# EAGLE schematic SLock_Main_Device (EAGLE 9.5.2)
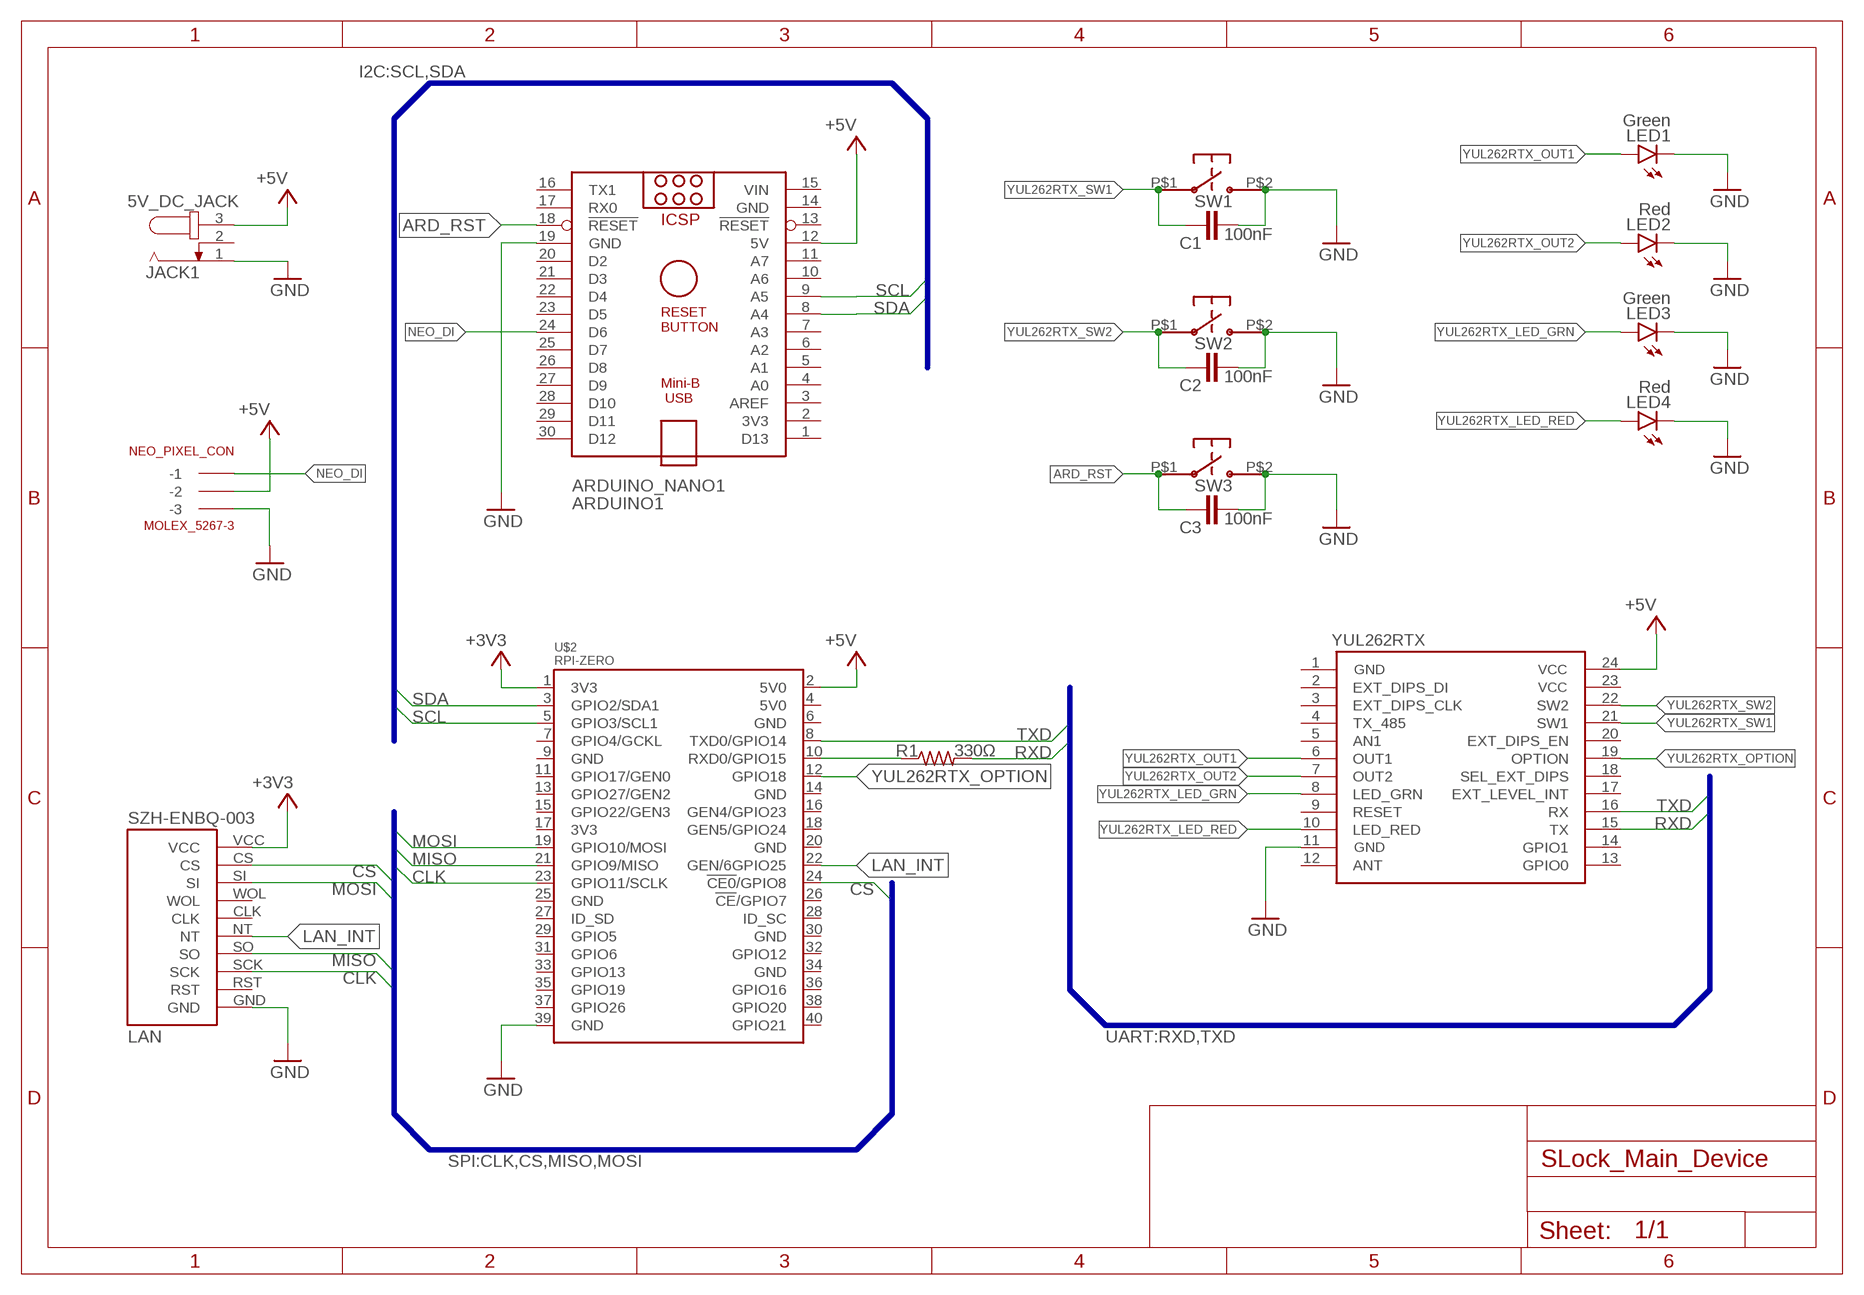
[diagram p0: schematic, sheet 1]

## Parts
5V_DC_JACK  JACK1  JACK-PLUG0  [SPC4077]
ARDUINO_NANO1  ARDUINO1  ARDUINO_NANO  [ARDUINO_NANO]
C1  100nF  C-EU050-024X044  [C050-024X044]
C2  100nF  C-EU050-024X044  [C050-024X044]
C3  100nF  C-EU050-024X044  [C050-024X044]
LAN  SZH-ENBQ-003  [SZH-ENBQ-003]
LED1  Green  LED3MM  [LED3MM]
LED2  Red  LED3MM  [LED3MM]
LED3  Green  LED3MM  [LED3MM]
LED4  Red  LED3MM  [LED3MM]
NEO_PIXEL_CON  MOLEX_5267-3  5267-3  [5267-3]
R1  330Ω  R-US_0204/7  [0204/7]
SW1  SKPDAMD010  [SKPDAMD010]
SW2  SKPDAMD010  [SKPDAMD010]
SW3  SKPDAMD010  [SKPDAMD010]
U$2  RPI-ZERO  [RASPBERRYPI_BASTELSTUBE_V13_RASPI_BOARD_B+_FULL]
YUL262RTX  YUL262RTX  YUL262RTXHOLE  [YUL262RXT_HOLE]

## Nets
+3V3: LAN.VCC U$2.1(3V3)
+5V: 5V_DC_JACK.3 ARDUINO_NANO1.12(5V) NEO_PIXEL_CON.P$2(-2) U$2.2(5V0) YUL262RTX.24(VCC_2)
ARD_RST: ARDUINO_NANO1.18(!RESET) C3.1 SW3.P$1
CLK: LAN.SCK U$2.23(GPIO11/SCLK)
CS: LAN.CS U$2.24(!CE0!/GPIO8)
GND: 5V_DC_JACK.1 ARDUINO_NANO1.19(GND) C1.2 C2.2 C3.2 LAN.GND LED1.K(C) LED2.K(C) LED3.K(C) LED4.K(C) NEO_PIXEL_CON.P$3(-3) SW1.P$2 SW2.P$2 SW3.P$2 U$2.39(GND) YUL262RTX.11(GND_1)
LAN_INT: LAN.NT U$2.22(GEN/6GPIO25)
MISO: LAN.SO U$2.21(GPIO9/MISO)
MOSI: LAN.SI U$2.19(GPIO10/MOSI)
NEO_DI: ARDUINO_NANO1.24(D6) NEO_PIXEL_CON.P$1(-1)
RXD: R1.2 YUL262RTX.15(TX)
RXD_INPUT: R1.1 U$2.10(RXD0/GPIO15)
SCL: ARDUINO_NANO1.9(A5) U$2.5(GPIO3/SCL1)
SDA: ARDUINO_NANO1.8(A4) U$2.3(GPIO2/SDA1)
TXD: U$2.8(TXD0/GPIO14) YUL262RTX.16(RX)
YUL262RTX_LED_GRN: LED3.A YUL262RTX.8(LED_GRN)
YUL262RTX_LED_RED: LED4.A YUL262RTX.10(LED_RED)
YUL262RTX_OPTION: U$2.12(GPIO18) YUL262RTX.19(OPTION)
YUL262RTX_OUT1: LED1.A YUL262RTX.6(OUT1)
YUL262RTX_OUT2: LED2.A YUL262RTX.7(OUT2)
YUL262RTX_SW1: C1.1 SW1.P$1 YUL262RTX.21(SW1)
YUL262RTX_SW2: C2.1 SW2.P$1 YUL262RTX.22(SW2)
Unconnected: 5V_DC_JACK.2 ARDUINO_NANO1.1(D13) ARDUINO_NANO1.2(3V3) ARDUINO_NANO1.3(AREF) ARDUINO_NANO1.4(A0) ARDUINO_NANO1.5(A1) ARDUINO_NANO1.6(A2) ARDUINO_NANO1.7(A3) ARDUINO_NANO1.10(A6) ARDUINO_NANO1.11(A7) ARDUINO_NANO1.13(!RESET) ARDUINO_NANO1.16(TX1) ARDUINO_NANO1.17(RX0) ARDUINO_NANO1.20(D2) ARDUINO_NANO1.21(D3) ARDUINO_NANO1.22(D4) ARDUINO_NANO1.23(D5) ARDUINO_NANO1.25(D7) ARDUINO_NANO1.26(D8) ARDUINO_NANO1.27(D9) ARDUINO_NANO1.28(D10) ARDUINO_NANO1.29(D11) ARDUINO_NANO1.30(D12) LAN.CLK LAN.RST LAN.WOL U$2.4(5V0) U$2.6(GND) U$2.7(GPIO4/GCKL) U$2.9(GND) U$2.11(GPIO17/GEN0) U$2.13(GPIO27/GEN2) U$2.14(GND) U$2.15(GPIO22/GEN3) U$2.16(GEN4/GPIO23) U$2.17(3V3) U$2.18(GEN5/GPIO24) U$2.20(GND) U$2.25(GND) U$2.26(!CE!/GPIO7) U$2.27(ID_SD) U$2.28(ID_SC) U$2.29(GPIO5) U$2.30(GND) U$2.31(GPIO6) U$2.32(GPIO12) U$2.33(GPIO13) U$2.34(GND) U$2.35(GPIO19) U$2.36(GPIO16) U$2.37(GPIO26) U$2.38(GPIO20) U$2.40(GPIO21) YUL262RTX.2(EXT_DIPS_DI) YUL262RTX.3(EXT_DIPS_CLK) YUL262RTX.4(TX_485) YUL262RTX.5(AN1) YUL262RTX.9(RESET) YUL262RTX.12(ANT) YUL262RTX.13(GPIO0) YUL262RTX.14(GPIO1) YUL262RTX.17(EXT_LEVEL_INT) YUL262RTX.18(SEL_EXT_DIPS) YUL262RTX.20(EXT_DIPS_EN)

## Buses
UART:RXD,TXD
I2C:SCL,SDA
SPI:CLK,CS,MISO,MOSI

## Power pins joined to a net without a drawn wire
GND: ARDUINO_NANO1.14(GND)
GND_2: YUL262RTX.1(GND_2)
VCC_1: YUL262RTX.23(VCC_1)
VIN: ARDUINO_NANO1.15(VIN)

## Library data of the parts
5V_DC_JACK = con-jack:JACK-PLUG: DC POWER JACK Power Jack, DC, Right Angle, Through Hole, Rated 5A at 16VDC, PC Terminals Distributor: Farnell (www.Farnell.de) Drawing: 84N1161.pdf / 84N1162.pdf Manufacturer: SPC Technology (www.spctechnology.com) Type: SPC4077 / SPC 4078; OC_FARNELL: unknown; OC_NEWARK: unknown
ARDUINO_NANO1 = ArduinoNanoV30:ARDUINO_NANO: Arduino Nano V3.0 Overview: The Arduino Nano is a small, complete, and breadboard-friendly board based on the ATmega328 (Arduino Nano 3.x) or ATmega168 (Arduino Nano 2.x). It has more or less the same functionality of the Arduino Duemilanove, but in a different package. It lacks only a DC power jack, and works with a Mini-B USB cable instead of a standard one. The Nano was designed and is being produced by Gravitech. Specifications: Microcontroller Atmel ATmega168 or ATmega328 Operating Voltage (logic level) 5 V Input Voltage (recommended) 7-12 V Input Voltage (limits) 6-20 V Digital I/O Pins 14 (of which 6 provide PWM output) Analog Input Pins 8 DC Current per I/O Pin 40 mA Flash Memory 16 KB (ATmega168) or 32 KB (ATmega328) of which 2 KB used by bootloader SRAM 1 KB (ATmega168) or 2 KB (ATmega328) EEPROM 512 bytes (ATmega168) or 1 KB (ATmega328) Clock Speed 16 MHz Dimensions 0.73" x 1.70" Length 45 mm Width 18 mm Weigth 5 g Power: The Arduino Nano can be powered via the Mini-B USB connection, 6-20V unregulated external power supply (pin 30), or 5V regulated external power supply (pin 27). The power source is automatically selected to the highest voltage source. Memory: The ATmega168 has 16 KB of flash memory for storing code (of which 2 KB is used for the bootloader); the ATmega328 has 32 KB, (also with 2 KB used for the bootloader). The ATmega168 has 1 KB of SRAM and 512 bytes of EEPROM (which can be read and written with the EEPROM library); the ATmega328 has 2 KB of SRAM and 1 KB of EEPROM. Input and Output: Each of the 14 digital pins on the Nano can be used as an input or output, using pinMode(), digitalWrite(), and digitalRead() functions. They operate at 5 volts. Each pin can provide or receive a maximum of 40 mA and has an internal pull-up resistor (disconnected by default) of 20-50 kOhms. In addition, some pins have specialized functions. Visit Arduino - ArduinoBoardNano <https://www.arduino.cc/en/Main/ArduinoBoardNano>
C1-C3 = rcl:C-EU: CAPACITOR, European symbol; SPICEPREFIX: C
LAN = SLock:SZH-ENBQ-003
LED1-LED4 = led:LED: LED OSRAM: - CHIPLED LG R971, LG N971, LY N971, LG Q971, LY Q971, LO R971, LY R971 LH N974, LH R974 LS Q976, LO Q976, LY Q976 LO Q996 - Hyper CHIPLED LW Q18S LB Q993, LB Q99A, LB R99A - SideLED LS A670, LO A670, LY A670, LG A670, LP A670 LB A673, LV A673, LT A673, LW A673 LH A674 LY A675 LS A676, LA A676, LO A676, LY A676, LW A676 LS A679, LY A679, LG A679 - Hyper Micro SIDELED® LS Y876, LA Y876, LO Y876, LY Y876 LT Y87S - SmartLED LW L88C, LW L88S LB L89C, LB L89S, LG L890 LS L89K, LO L89K, LY L89K LS L896, LA L896, LO L896, LY L896 - TOPLED LS T670, LO T670, LY T670, LG T670, LP T670 LSG T670, LSP T670, LSY T670, LOP T670, LYG T670 LG T671, LOG T671, LSG T671 LB T673, LV T673, LT T673, LW T673 LH T674 LS T676, LA T676, LO T676, LY T676, LB T676, LH T676, LSB T676, LW T676 LB T67C, LV T67C, LT T67C, LS T67K, LO T67K, LY T67K, LW E67C LS E67B, LA E67B, LO E67B, LY E67B, LB E67C, LV E67C, LT E67C LW T67C LS T679, LY T679, LG T679 LS T770, LO T770, LY T770, LG T770, LP T770 LB T773, LV T773, LT T773, LW T773 LH T774 LS E675, LA E675, LY E675, LS T675 LS T776, LA T776, LO T776, LY T776, LB T776 LHGB T686 LT T68C, LB T68C - Hyper Mini TOPLED® LB M676 - Mini TOPLED Santana® LG M470 LS M47K, LO M47K, LY M47K Source: http://www.osram.convergy.de LUXEON: - LUMILED® LXK2-PW12-R00, LXK2-PW12-S00, LXK2-PW14-U00, LXK2-PW14-V00 LXK2-PM12-R00, LXK2-PM12-S00, LXK2-PM14-U00 LXK2-PE12-Q00, LXK2-PE12-R00, LXK2-PE12-S00, LXK2-PE14-T00, LXK2-PE14-U00 LXK2-PB12-K00, LXK2-PB12-L00, LXK2-PB12-M00, LXK2-PB14-N00, LXK2-PB14-P00, LXK2-PB14-Q00 LXK2-PR12-L00, LXK2-PR12-M00, LXK2-PR14-Q00, LXK2-PR14-R00 LXK2-PD12-Q00, LXK2-PD12-R00, LXK2-PD12-S00 LXK2-PH12-R00, LXK2-PH12-S00 LXK2-PL12-P00, LXK2-PL12-Q00, LXK2-PL12-R00 Source: www.luxeon.com KINGBRIGHT: KA-3528ASYC Source: www.kingbright.com
NEO_PIXEL_CON = con-molex-spox:5267-3
R1 = rcl:R-US_: RESISTOR, American symbol; SPICEPREFIX: R
SW1-SW3 = switches:SKPDAMD010; MOUSER: 688-SKPDAM
U$2 = RPI-Zero:RPI-ZERO
YUL262RTX = SLock:YUL262RTX